# Altium project RoboticCar.PrjPcb
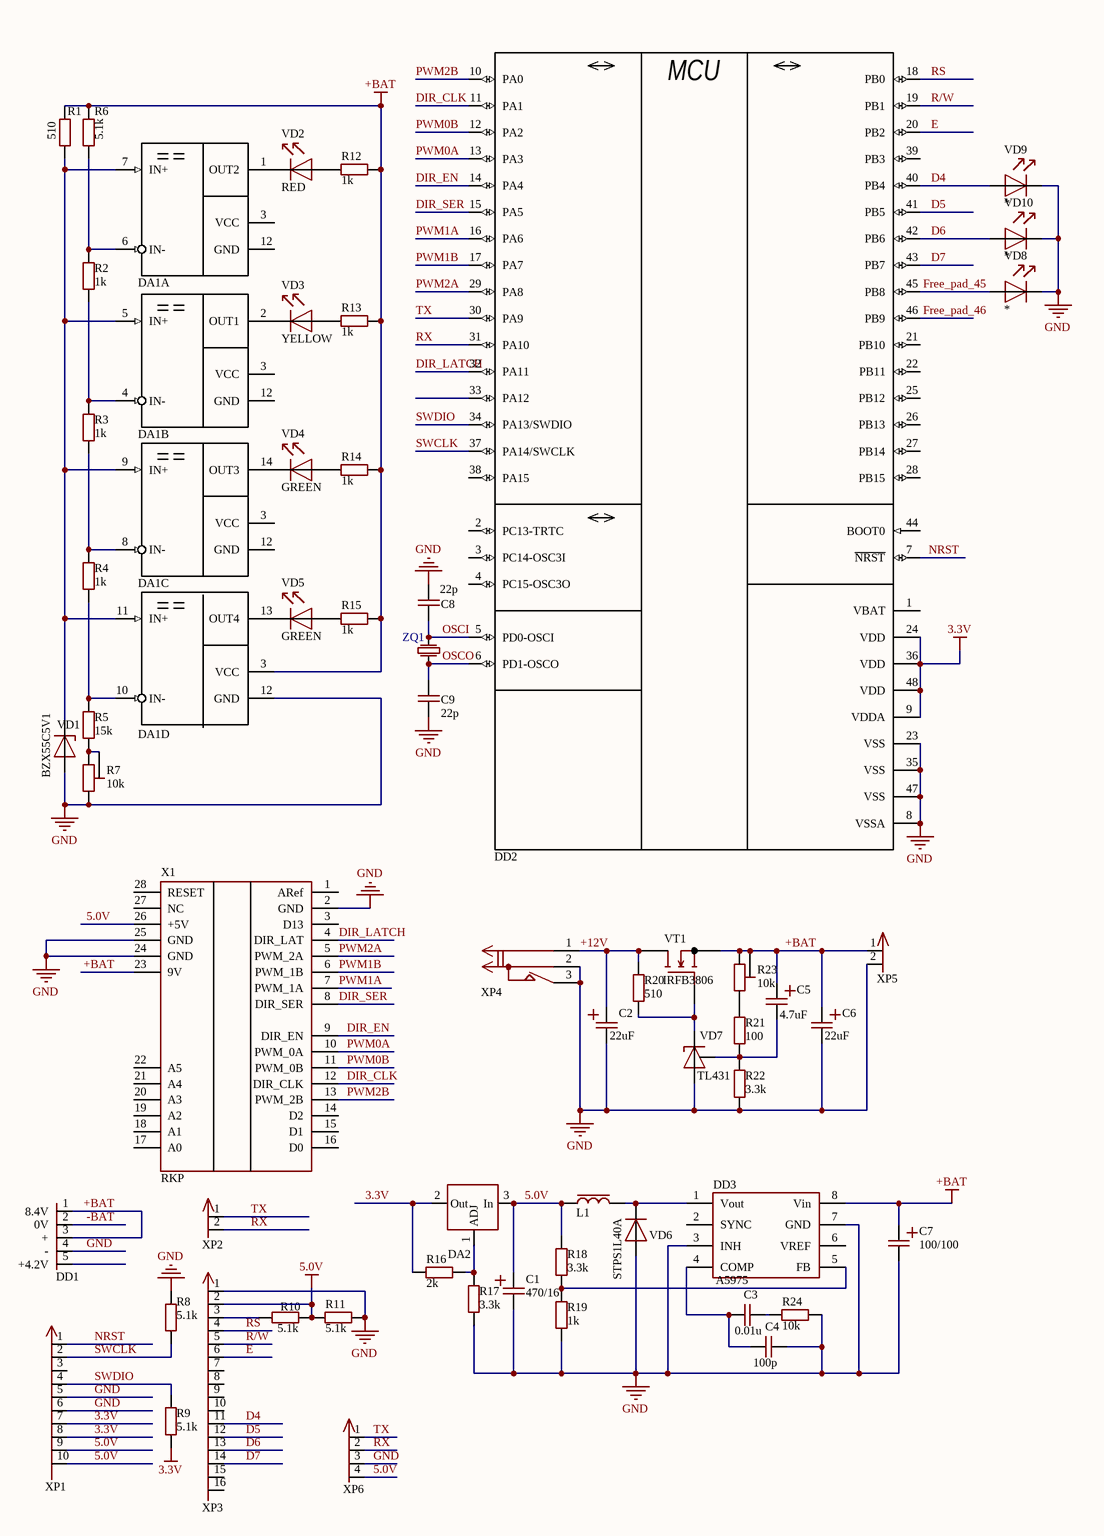
[diagram p0: Sheet1.SchDoc]
1 sheet, 58 parts. Net scope: global (net labels, ports and power ports of the same name join across sheets).
Board file: PCB1.PcbDoc

## Sheet Sheet1.SchDoc
size A3 portrait

### Parts
C1  470/16  [ECAP_10_5]
C2  22uF  [ECAP_10_5]
C3  0.01u  [C0805]
C4  100p  [C0805]
C5  4.7uF  [ECAP_10_5]
C6  22uF  [ECAP_10_5]
C7  100/100  [ECAP_10_5]
C8  22p  [C0805]
C9  22p  [C0805]
DA1  *  [SOP14]  (value not drawn)  (parts A,B,C,D of 4)
DA2  LM117  [SOT-223]  (value not drawn)
DD1  REV1.4  [20A8.4ВREV1.2]  (value not drawn)
DD2  *  [LQFP-48]  (value not drawn)
DD3  A5975  [SOIC8]
L1  CDRH127/LDNP-220MC  [CDRH127]  (value not drawn)
R1  510  [R0805]
R2  1k  [R0805]
R3  1k  [R0805]
R4  1k  [R0805]
R5  15k  [R0805]
R6  5.1k  [R0805]
R7  10k  [T93YA]
R8  5.1k  [R0805]
R9  5.1k  [R0805]
R10  5.1k  [R0805]
R11  5.1k  [R0805]
R12  1k  [R0805]
R13  1k  [R0805]
R14  1k  [R0805]
R15  1k  [R0805]
R16  2k  [R0805]
R17  3.3k  [R0805]
R18  3.3k  [R0805]
R19  1k  [R0805]
R20  510  [R0805]
R21  100  [R0805]
R22  3.3k  [R0805]
R23  10k  [T93YA]
R24  10k  [R0805]
VD1  BZX55C5V1  [DO-35]
VD2  RED  [LED-5mm]
VD3  YELLOW  [LED-5mm]
VD4  GREEN  [LED-5mm]
VD5  GREEN  [LED-5mm]
VD6  STPS1L40A  [DO-214AC]
VD7  TL431  [TO-92]
VD8  *  [LED-5mm]
VD9  *  [LED-5mm]
VD10  *  [LED-5mm]
VT1  IRFB3806  [TO-220+FK]
X1  RKP  [ARDUINO SHIELD]
XP1  *  [IDC10M]  (value not drawn)
XP2  JAMPER  [PLS-2]  (value not drawn)
XP3  *  [IDC16M]  (value not drawn)
XP4  *  [DJK-02-Series]  (value not drawn)
XP5  JAMPER  [PLS-2]  (value not drawn)
XP6  JAMPER  [PLS-4]  (value not drawn)
ZQ1  *  [HC-49S]  (value not drawn)

### Nets
3.3V: DA2.2(Out) DD2.9(VDDA) DD2.24(VDD) DD2.36(VDD) DD2.48(VDD) R9.1 R16.2 XP1.7 XP1.8
5.0V: C1.1 DA2.3(In) L1.1 R10.2 R11.1 R18.2 X1.26(+5V) XP1.9 XP1.10 XP3.2 XP6.4
+BAT: C5.1 C6.1 C7.1 DA1.3(VCC) DD1.1(8.4V) DD1.3(+) DD3.8(Vin) R1.2 R6.2 R12.2 R13.2 R14.2 R15.2 R23.1 R23.2 VT1.3(S) X1.23(9V) XP5.1
GND: C1.2 C2.2 C4.1 C6.2 C7.2 C8.2 C9.1 DA1.12(GND) DD1.4(-) DD2.8(VSSA) DD2.23(VSS) DD2.35(VSS) DD2.47(VSS) DD3.3(INH) DD3.7(GND) R7.3 R8.1 R11.2 R17.1 R19.1 R22.1 R24.1 VD1.1(А) VD6.1(А) VD7.2(А) VD8.2(К) VD9.2(К) VD10.2(К) X1.2(GND) X1.24(GND) X1.25(GND) XP1.5 XP1.6 XP3.1 XP4.2 XP4.3 XP5.2 XP6.3
+12V: C2.1 R20.2 VT1.2(D) XP4.1
-BAT: DD1.2(0V)
D4: DD2.40(PB4) VD9.1(А) XP3.11
D5: DD2.41(PB5) XP3.12
D6: DD2.42(PB6) VD10.1(А) XP3.13
D7: DD2.43(PB7) XP3.14
DIR_CLK: DD2.11(PA1) X1.12(DIR_CLK)
DIR_EN: DD2.14(PA4) X1.9(DIR_EN)
DIR_LATCH: DD2.32(PA11) X1.4(DIR_LAT)
DIR_SER: DD2.15(PA5) X1.8(DIR_SER)
E: DD2.20(PB2) XP3.6
Free_pad_45: DD2.45(PB8) VD8.1(А)
Free_pad_46: DD2.46(PB9)
NRST: DD2.7(~{NRST}) XP1.1
OSCI: C8.1 DD2.5(PD0-OSCI) ZQ1.3
OSCO: C9.2 DD2.6(PD1-OSCO) ZQ1.1
PWM0A: DD2.13(PA3) X1.10(PWM_0A)
PWM0B: DD2.12(PA2) X1.11(PWM_0B)
PWM1A: DD2.16(PA6) X1.7(PWM_1A)
PWM1B: DD2.17(PA7) X1.6(PWM_1B)
PWM2A: DD2.29(PA8) X1.5(PWM_2A)
PWM2B: DD2.10(PA0) X1.13(PWM_2B)
R/W: DD2.19(PB1) XP3.5
RS: DD2.18(PB0) XP3.4
RX: DD2.31(PA10) XP2.2 XP6.2
SWCLK: DD2.37(PA14/SWCLK) R8.2 XP1.2
SWDIO: DD2.34(PA13/SWDIO) R9.2 XP1.4
TX: DD2.30(PA9) XP2.1 XP6.1
NetC3_1: C3.1 R24.2
NetC3_2: C3.2 C4.2 DD3.4(COMP)
NetC5_2: C5.2 R21.1 R22.2 VD7.3(R)
NetDA1_1: DA1.1(OUT2) VD2.2(К)
NetDA1_2: DA1.2(OUT1) VD3.2(К)
NetDA1_4: DA1.4(IN-) R2.1 R3.2
NetDA1_5: DA1.5(IN+) DA1.7(IN+) DA1.9(IN+) DA1.11(IN+) R1.1 VD1.2(К)
NetDA1_6: DA1.6(IN-) R2.2 R6.1
NetDA1_8: DA1.8(IN-) R3.1 R4.2
NetDA1_10: DA1.10(IN-) R4.1 R5.2
NetDA1_13: DA1.13(OUT4) VD5.2(К)
NetDA1_14: DA1.14(OUT3) VD4.2(К)
NetDA2_1: DA2.1(ADJ) R16.1 R17.2
NetDD3_1: DD3.1(Vout) L1.2 VD6.2(К)
NetDD3_5: DD3.5(FB) R18.1 R19.2
NetR5_1: R5.1 R7.1 R7.2
NetR10_1: R10.1 XP3.3
NetR12_1: R12.1 VD2.1(А)
NetR13_1: R13.1 VD3.1(А)
NetR14_1: R14.1 VD4.1(А)
NetR15_1: R15.1 VD5.1(А)
NetR20_1: R20.1 VD7.1(К) VT1.1(G)
NetR21_2: R21.2 R23.3

Not connected (* = marked no-connect by the designer): DD1 5(+4.2V); DD2 1(VBAT) 2(PC13-TRTC) 3(PC14-OSC3I) 4(PC15-OSC3O) 21(PB10) 22(PB11) 25(PB12) 26(PB13) 27(PB14) 28(PB15) 33(PA12) 38(PA15) 39(PB3) 44(BOOT0); DD3 2(SYNC) 6(VREF); X1 1(ARef) 3(D13) 14(D2) 15(D1) 16(D0) 17(A0) 18(A1) 19(A2) 20(A3) 21(A4) 22(A5) 27(NC) 28(RESET); XP1 3; XP3 7 8 9 10 15 16

### Notes on the sheet
- (in symbol STM32F103Cxxx-Series) MCU

### Library data of the parts
C1 C2 C5-C7 = CAP-E: Type: ECAP_10_5
  C1: Value: 470/16
  C2 C6: Value: 22uF
  C5: Value: 4.7uF
  C7: Value: 100/100
C3 C4 C8 C9 = CAP: Type: C0805
  C3: Value: 0.01u
  C4: Value: 100p
  C8 C9: Value: 22p
DA1 = LM339: Value: *; Type: SOP14
DD2 = STM32F103Cxxx-Series: Value: *; Type: LQFP-48
DD3 = A5975: STEP-DOWN; HelpURL: *; Type: SOIC8; Value: A5975
L1 = Coil: Value: CDRH127/LDNP-220MC; Type: CDRH127
R1-R6 R8-R22 R24 = RES: Type: R0805
  R1 R20: Value: 510
  R2-R4 R12-R15 R19: Value: 1k
  R5: Value: 15k
  R6 R8-R11: Value: 5.1k
  R16: Value: 2k
  R17 R18 R22: Value: 3.3k
  R21: Value: 100
  R24: Value: 10k
R7 R23 = Resistor Trimmers: Type: T93YA; Value: 10k
VD1 = Zender: Value: BZX55C5V1; Type: DO-35
VD2-VD5 VD8-VD10 = LED: Type: LED-5mm
  VD2: Value: RED
  VD3: Value: YELLOW
  VD4 VD5: Value: GREEN
  VD8-VD10: Value: *
VD6 = Diode: Value: STPS1L40A; Type: DO-214AC
VT1 = MOSFET-N: Value: IRFB3806; Type: TO-220+FK
X1 = MOTOR_SHIELD: HelpURL: *; Type: arduino; Value: RKP
XP1 = IDC10M: Type: IDC10M; Value: *
XP2 XP5 = CONNX2: Value: JAMPER; Type: PLS-2
XP3 = IDC16M: Type: IDC16M; Value: *
XP4 = Con-2-M-DP: Value: *; Type: DJK-02-Series
XP6 = CONNX4: Value: JAMPER; Type: PLS-4
ZQ1 = Crystal: Value: *; Type: HC-49S
DA2 = LM117: Value: LM117; Type: SOT-223
DD1 = REV1.4: Type: 20A8.4ВREV1.2; Value: *
VD7 = TL431: Value: TL431; Type: TO-92